# Altium schematic sheet NEH.SchDoc
size Letter; SheetNumber: 1; SheetTotal: 3
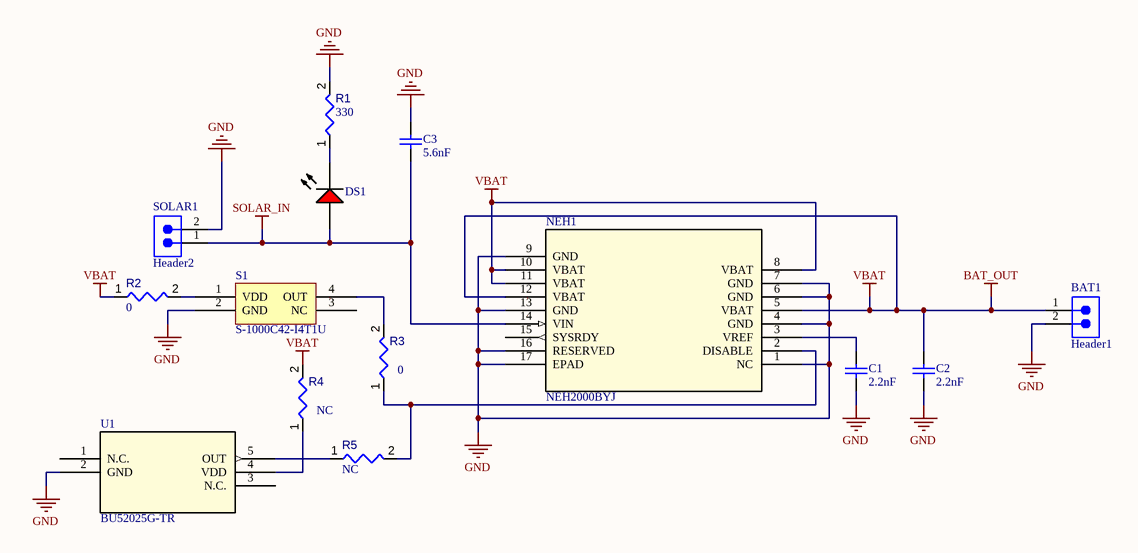
[diagram p0: NEH.SchDoc]

## Parts
BAT1  Header1  [61300211121]
C1  value 2.2nF  [CAPC0603X33X15LL03T05]  (hidden comment: 0201YD222KAT2A)
C2  value 2.2nF  [CAPC0603X33X15LL03T05]  (hidden comment: 0201YD222KAT2A)
C3  value 5.6nF  [rlc_402_smd_small]  (hidden comment: Cap)
DS1  19-217/R6C-AL1M2VY/3T  [EVRL-0603-2_V]  (value not drawn)
NEH1  NEH2000BYJ  [HWQFN16_SOT8076-1_NEX]
R1  value 330  [RESC0402(1005)_L]  (hidden comment: 330R2J)
R2  value 0  [RESC0603(1608)_L]  (hidden comment: Jumper 0603)
R3  value 0  [RESC0603(1608)_L]  (hidden comment: Jumper 0603)
R4  value NC  [RESC0603(1608)_L]  (hidden comment: Jumper 0603)
R5  value NC  [RESC0603(1608)_L]  (hidden comment: Jumper 0603)
S1  S-1000C42-I4T1U  [SON65P140X48_HS-5N]
SOLAR1  Header2  [61300211121]
U1  BU52025G-TR  [SSOP5_ROM]

## Nets
BAT_OUT: BAT1.1 C2.2 NEH1.5(VBAT) NEH1.8(VBAT) NEH1.10(VBAT) NEH1.11(VBAT) NEH1.12(VBAT) R2.1 R4.2  [also labelled VBAT]
GND: BAT1.2 C1.1 C2.1 C3.2 NEH1.1(NC) NEH1.4(GND) NEH1.6(GND) NEH1.7(GND) NEH1.9(GND) NEH1.13(GND) NEH1.16(RESERVED) NEH1.17(EPAD) R1.2 S1.2(GND) SOLAR1.2 U1.2(GND)
SOLAR_IN: C3.1 DS1.1(A) NEH1.14(VIN) SOLAR1.1
NetC1_2: C1.2 NEH1.3(VREF)
NetDS1_2: DS1.2(K) R1.1
NetNEH1_2: NEH1.2(DISABLE) R3.1 R5.2
NetR2_2: R2.2 S1.1(VDD)
NetR3_2: R3.2 S1.4(OUT)
NetR4_1: R4.1 U1.4(VDD)
NetR5_1: R5.1 U1.5(OUT)

Not connected (* = marked no-connect by the designer): NEH1 15(SYSRDY); S1 3(NC); U1 1(N.C.) 3(N.C.)

## Library data of the parts
BAT1 SOLAR1 = CMP-002-00071-1: Board Connector, 2 Contact(s), 1 Row(s), Male, Straight, 0.1 inch Pitch, Solder Terminal, Locking, Black Insulator, Plug; Max Operating Temperature: 125°C; Connector Type: BOARD CONNECTOR; Min Operating Temperature: -40°C; RoHS Compliant: Yes; Mounting Technology: Board
C1 C2 = CMP-001-00084-1: Ceramic Capacitor, Multilayer, Ceramic, 16V, 10% +Tol, 10% -Tol, X5R, 15% TC, 0.0022uF, Surface Mount, 0201; Case/Package: 0201; Mounting Technology: Surface Mount; Min Operating Temperature: -55°C; Max Operating Temperature: 85°C; Pins: 2; Capacitor Type: Ceramic; RoHS Compliant: Yes
C3 = Cap: Capacitor SMD; Published: 8-Jun-2000; LatestRevisionDate: 05-oct-2007  -  Semtech; LatestRevisionNote: Re-released for DXP Platform.; Publisher: Altium Limited
DS1 = CMP-007-00004-2: Chip LED, Red, 5 V, 25 mA, -40 to 85 degC, 2-Pin SMD (0603), RoHS, Tape and Reel; Manufacturer: Everlight Electronics; Forward Voltage: 2.2V; Lens Style: Clear; Package Reference: 0603; Datasheet Version: Rev. 1, 01/2005; Mounting Technology: SM; RoHS Compliant: False; Datasheet URL: https://datasheet.ciiva.com/4688/el-19-217-r6c-al1m2vy-3tpdf-187026-4688713.pdf; Case/Package: 0603; Colour: Red; Manufacturer URL: http://www.everlight.com/; Package Description: 2-Pin Surface Mount Device, Body 1.6 x 0.8 mm
NEH1 = NEH2000BYJ: No Description Available; Mfr_Name: Nexperia; Type: DEV; Copyright: Copyright (C) 2023 Ultra Librarian. All rights reserved.; Manufacturer_Part_Number: NEH2000BYJ; RefDes: RefDes
R1 = CMP-009-00095-2: 330R 0.063W 5% 0402 (1005 Metric)  SMD; Power: 63mW; Tolerance: 5%; Mounting Technology: SMT; Case/Package: 0402; Pins: 2
R2-R5 = CMP-009-00175-3: Pins: 2; Min Operating Temperature: -55°C; Max Operating Temperature: 155°C; Case/Package: 0603
S1 = CMP-00029-00001-4: Voltage Detector
U1 = BU52025G-TR: No Description Available; Mfr_Name: ROHM Semiconductor; RefDes: RefDes; Type: Type